# Altium project STM32-ROMI_Rev_A.PrjPcb (part 3 of 3)
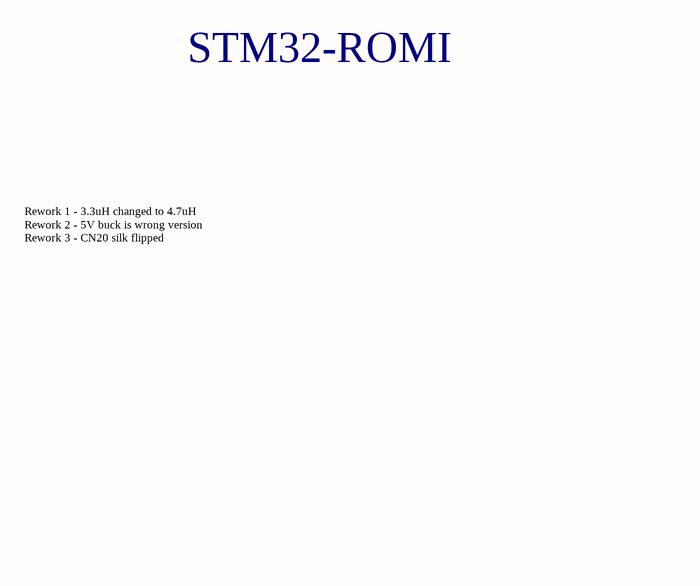
[diagram p6: STM32-ROMI_Rev_A_6_Reworks.SchDoc]

## Nets that join several sheets
3.3V: STM32-ROMI_Rev_A_1_STM32 (31 pins), STM32-ROMI_Rev_A_2_Connectors (11 pins), STM32-ROMI_Rev_A_3_OLED_Sensor (9 pins), STM32-ROMI_Rev_A_4_3V_5V (8 pins), STM32-ROMI_Rev_A_5_IMU_IO (27 pins)
5V: STM32-ROMI_Rev_A_2_Connectors (5 pins), STM32-ROMI_Rev_A_3_OLED_Sensor (10 pins), STM32-ROMI_Rev_A_4_3V_5V (12 pins)
5V_USB: STM32-ROMI_Rev_A_3_OLED_Sensor (C54.1 C55.1 CN16.1), STM32-ROMI_Rev_A_4_3V_5V (U15.3 U17.1)
GND: STM32-ROMI_Rev_A_1_STM32 (36 pins), STM32-ROMI_Rev_A_2_Connectors (34 pins), STM32-ROMI_Rev_A_3_OLED_Sensor (11 pins), STM32-ROMI_Rev_A_4_3V_5V (27 pins), STM32-ROMI_Rev_A_5_IMU_IO (31 pins)
RPI_5V: STM32-ROMI_Rev_A_2_Connectors (CN18.2 CN18.4), STM32-ROMI_Rev_A_4_3V_5V (C52.1 C53.1 U7.6)
VBAT: STM32-ROMI_Rev_A_2_Connectors (CN3.1 CN3.3 CN3.5 R49.2), STM32-ROMI_Rev_A_4_3V_5V (5 pins)
VSW: STM32-ROMI_Rev_A_2_Connectors (CN3.13 CN3.15), STM32-ROMI_Rev_A_4_3V_5V (R71.1)
ADC_IN1: STM32-ROMI_Rev_A_1_STM32 (U1.15), STM32-ROMI_Rev_A_2_Connectors (CN5.2 R49.1 R50.2)
CAN_RX: STM32-ROMI_Rev_A_1_STM32 (U1.44), STM32-ROMI_Rev_A_5_IMU_IO (CN23.1)
CAN_TX: STM32-ROMI_Rev_A_1_STM32 (U1.45), STM32-ROMI_Rev_A_5_IMU_IO (CN23.3)
DAC_OUT1: STM32-ROMI_Rev_A_1_STM32 (U1.20), STM32-ROMI_Rev_A_2_Connectors (CN5.3)
ECHO_CTR: STM32-ROMI_Rev_A_1_STM32 (U1.38), STM32-ROMI_Rev_A_2_Connectors (CN11.3)
ECHOL: STM32-ROMI_Rev_A_1_STM32 (U1.57), STM32-ROMI_Rev_A_2_Connectors (CN9.3)
ECHOR: STM32-ROMI_Rev_A_1_STM32 (U1.42), STM32-ROMI_Rev_A_2_Connectors (CN10.3)
ENCL_CHA: STM32-ROMI_Rev_A_1_STM32 (U1.29), STM32-ROMI_Rev_A_2_Connectors (CN13.2)
ENCL_CHB: STM32-ROMI_Rev_A_1_STM32 (U1.30), STM32-ROMI_Rev_A_2_Connectors (CN13.3)
ENCR_CHA: STM32-ROMI_Rev_A_1_STM32 (U1.26), STM32-ROMI_Rev_A_2_Connectors (CN14.2)
ENCR_CHB: STM32-ROMI_Rev_A_1_STM32 (U1.27), STM32-ROMI_Rev_A_2_Connectors (CN14.3)
I2C1_SCL: STM32-ROMI_Rev_A_1_STM32 (U1.61), STM32-ROMI_Rev_A_2_Connectors (CN12.3), STM32-ROMI_Rev_A_3_OLED_Sensor (CN17.3 R9.1), STM32-ROMI_Rev_A_5_IMU_IO (R59.1 R66.1 U4.19 U6.19)
I2C1_SDA: STM32-ROMI_Rev_A_1_STM32 (U1.59), STM32-ROMI_Rev_A_2_Connectors (CN12.4), STM32-ROMI_Rev_A_3_OLED_Sensor (CN17.4 R10.1), STM32-ROMI_Rev_A_5_IMU_IO (R58.1 R65.1 U4.20 U6.20)
I2C3_SCL: STM32-ROMI_Rev_A_1_STM32 (U1.41), STM32-ROMI_Rev_A_5_IMU_IO (R56.1 U5.19)
I2C3_SDA: STM32-ROMI_Rev_A_1_STM32 (U1.40), STM32-ROMI_Rev_A_5_IMU_IO (R57.1 U5.20)
IMU_RST: STM32-ROMI_Rev_A_1_STM32 (U1.8), STM32-ROMI_Rev_A_5_IMU_IO (R53.1 U5.11)
LEDL_B1: STM32-ROMI_Rev_A_3_OLED_Sensor (R17.1), STM32-ROMI_Rev_A_5_IMU_IO (U4.1)
LEDL_B2: STM32-ROMI_Rev_A_3_OLED_Sensor (R18.1), STM32-ROMI_Rev_A_5_IMU_IO (U4.4)
LEDL_B3: STM32-ROMI_Rev_A_3_OLED_Sensor (R33.1), STM32-ROMI_Rev_A_5_IMU_IO (U4.7)
LEDL_B4: STM32-ROMI_Rev_A_3_OLED_Sensor (R34.1), STM32-ROMI_Rev_A_5_IMU_IO (U4.11)
LEDL_B5: STM32-ROMI_Rev_A_3_OLED_Sensor (R43.1), STM32-ROMI_Rev_A_5_IMU_IO (U4.14)
LEDL_G1: STM32-ROMI_Rev_A_3_OLED_Sensor (R25.1), STM32-ROMI_Rev_A_5_IMU_IO (U4.3)
LEDL_G2: STM32-ROMI_Rev_A_3_OLED_Sensor (R26.1), STM32-ROMI_Rev_A_5_IMU_IO (U4.6)
LEDL_G3: STM32-ROMI_Rev_A_3_OLED_Sensor (R37.1), STM32-ROMI_Rev_A_5_IMU_IO (U4.10)
LEDL_G4: STM32-ROMI_Rev_A_3_OLED_Sensor (R38.1), STM32-ROMI_Rev_A_5_IMU_IO (U4.13)
LEDL_G5: STM32-ROMI_Rev_A_3_OLED_Sensor (R45.1), STM32-ROMI_Rev_A_5_IMU_IO (U4.16)
LEDL_R1: STM32-ROMI_Rev_A_3_OLED_Sensor (R29.1), STM32-ROMI_Rev_A_5_IMU_IO (U4.2)
LEDL_R2: STM32-ROMI_Rev_A_3_OLED_Sensor (R30.1), STM32-ROMI_Rev_A_5_IMU_IO (U4.5)
LEDL_R3: STM32-ROMI_Rev_A_3_OLED_Sensor (R41.1), STM32-ROMI_Rev_A_5_IMU_IO (U4.8)
LEDL_R4: STM32-ROMI_Rev_A_3_OLED_Sensor (R42.1), STM32-ROMI_Rev_A_5_IMU_IO (U4.12)
LEDL_R5: STM32-ROMI_Rev_A_3_OLED_Sensor (R47.1), STM32-ROMI_Rev_A_5_IMU_IO (U4.15)
LEDR_B1: STM32-ROMI_Rev_A_3_OLED_Sensor (R44.1), STM32-ROMI_Rev_A_5_IMU_IO (U6.1)
LEDR_B2: STM32-ROMI_Rev_A_3_OLED_Sensor (R11.1), STM32-ROMI_Rev_A_5_IMU_IO (U6.4)
LEDR_B3: STM32-ROMI_Rev_A_3_OLED_Sensor (R12.1), STM32-ROMI_Rev_A_5_IMU_IO (U6.7)
LEDR_B4: STM32-ROMI_Rev_A_3_OLED_Sensor (R31.1), STM32-ROMI_Rev_A_5_IMU_IO (U6.11)
LEDR_B5: STM32-ROMI_Rev_A_3_OLED_Sensor (R32.1), STM32-ROMI_Rev_A_5_IMU_IO (U6.14)
LEDR_G1: STM32-ROMI_Rev_A_3_OLED_Sensor (R46.1), STM32-ROMI_Rev_A_5_IMU_IO (U6.3)
LEDR_G2: STM32-ROMI_Rev_A_3_OLED_Sensor (R23.1), STM32-ROMI_Rev_A_5_IMU_IO (U6.6)
LEDR_G3: STM32-ROMI_Rev_A_3_OLED_Sensor (R24.1), STM32-ROMI_Rev_A_5_IMU_IO (U6.10)
LEDR_G4: STM32-ROMI_Rev_A_3_OLED_Sensor (R35.1), STM32-ROMI_Rev_A_5_IMU_IO (U6.13)
LEDR_G5: STM32-ROMI_Rev_A_3_OLED_Sensor (R36.1), STM32-ROMI_Rev_A_5_IMU_IO (U6.16)
LEDR_R1: STM32-ROMI_Rev_A_3_OLED_Sensor (R48.1), STM32-ROMI_Rev_A_5_IMU_IO (U6.2)
LEDR_R2: STM32-ROMI_Rev_A_3_OLED_Sensor (R27.1), STM32-ROMI_Rev_A_5_IMU_IO (U6.5)
LEDR_R3: STM32-ROMI_Rev_A_3_OLED_Sensor (R28.1), STM32-ROMI_Rev_A_5_IMU_IO (U6.8)
LEDR_R4: STM32-ROMI_Rev_A_3_OLED_Sensor (R39.1), STM32-ROMI_Rev_A_5_IMU_IO (U6.12)
LEDR_R5: STM32-ROMI_Rev_A_3_OLED_Sensor (R40.1), STM32-ROMI_Rev_A_5_IMU_IO (U6.15)
OLED_BTN: STM32-ROMI_Rev_A_1_STM32 (U1.2), STM32-ROMI_Rev_A_3_OLED_Sensor (C24.1 R8.1 SW2.1 SW2.2)
QTRL_OUT: STM32-ROMI_Rev_A_1_STM32 (U1.33), STM32-ROMI_Rev_A_2_Connectors (CN7.4)
QTRR_OUT: STM32-ROMI_Rev_A_1_STM32 (U1.28), STM32-ROMI_Rev_A_2_Connectors (CN8.4)
RGB_INT1: STM32-ROMI_Rev_A_1_STM32 (U1.24), STM32-ROMI_Rev_A_5_IMU_IO (R60.1 U4.22)
RGB_INT2: STM32-ROMI_Rev_A_1_STM32 (U1.25), STM32-ROMI_Rev_A_5_IMU_IO (R67.1 U6.22)
ROMI_DIRL: STM32-ROMI_Rev_A_1_STM32 (U1.53), STM32-ROMI_Rev_A_2_Connectors (CN1.2)
ROMI_DIRR: STM32-ROMI_Rev_A_1_STM32 (U1.34), STM32-ROMI_Rev_A_2_Connectors (CN1.5)
ROMI_PG: STM32-ROMI_Rev_A_2_Connectors (CN2.7), STM32-ROMI_Rev_A_5_IMU_IO (U4.17)
ROMI_PWML: STM32-ROMI_Rev_A_1_STM32 (U1.58), STM32-ROMI_Rev_A_2_Connectors (CN1.3)
ROMI_PWMR: STM32-ROMI_Rev_A_1_STM32 (U1.14), STM32-ROMI_Rev_A_2_Connectors (CN1.6)
ROMI_~{SLPL}: STM32-ROMI_Rev_A_1_STM32 (U1.37), STM32-ROMI_Rev_A_2_Connectors (CN1.1)
ROMI_~{SLPR}: STM32-ROMI_Rev_A_1_STM32 (U1.35), STM32-ROMI_Rev_A_2_Connectors (CN1.4)
ROMI_SHDN: STM32-ROMI_Rev_A_2_Connectors (CN2.9), STM32-ROMI_Rev_A_5_IMU_IO (U6.17)
RXO: STM32-ROMI_Rev_A_2_Connectors (CN6.8), STM32-ROMI_Rev_A_3_OLED_Sensor (CN19.1)
SERVO1_PWM: STM32-ROMI_Rev_A_1_STM32 (U1.36), STM32-ROMI_Rev_A_2_Connectors (CN22.2)
SERVO2_PWM: STM32-ROMI_Rev_A_1_STM32 (U1.62), STM32-ROMI_Rev_A_2_Connectors (CN15.2)
SPI1_MISO: STM32-ROMI_Rev_A_1_STM32 (U1.22 U2.2), STM32-ROMI_Rev_A_2_Connectors (CN21.2)
SPI1_MOSI: STM32-ROMI_Rev_A_1_STM32 (U1.23 U2.5), STM32-ROMI_Rev_A_2_Connectors (CN21.3)
SPI1_SCK: STM32-ROMI_Rev_A_1_STM32 (U1.55 U2.6), STM32-ROMI_Rev_A_2_Connectors (CN21.4)
SPI_CS_AUX: STM32-ROMI_Rev_A_1_STM32 (U1.50), STM32-ROMI_Rev_A_2_Connectors (CN21.1)
TRIG_CTR: STM32-ROMI_Rev_A_1_STM32 (U1.39), STM32-ROMI_Rev_A_2_Connectors (CN11.2)
TRIGL: STM32-ROMI_Rev_A_1_STM32 (U1.56), STM32-ROMI_Rev_A_2_Connectors (CN9.2)
TRIGR: STM32-ROMI_Rev_A_1_STM32 (U1.43), STM32-ROMI_Rev_A_2_Connectors (CN10.2)
TXO: STM32-ROMI_Rev_A_2_Connectors (CN6.1), STM32-ROMI_Rev_A_3_OLED_Sensor (CN20.1)
UART2_RX: STM32-ROMI_Rev_A_1_STM32 (R22.2), STM32-ROMI_Rev_A_3_OLED_Sensor (CN20.2)
UART2_TX: STM32-ROMI_Rev_A_1_STM32 (R21.2), STM32-ROMI_Rev_A_3_OLED_Sensor (CN19.2)
UART4_RX: STM32-ROMI_Rev_A_1_STM32 (U1.52), STM32-ROMI_Rev_A_2_Connectors (R52.1)
UART4_TX: STM32-ROMI_Rev_A_1_STM32 (U1.51), STM32-ROMI_Rev_A_2_Connectors (R51.1)